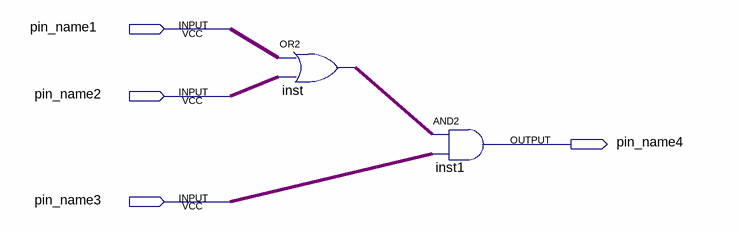
[diagram p0: schematic sheet]
// Quartus schematic Project2.bdf as structural Verilog: 2 symbols, 4 pins
module Project2 (
  input  pin_name1,
  input  pin_name2,
  input  pin_name3,
  output pin_name4
);

  wire inst_out;

  or inst (inst_out, pin_name1, pin_name2);
  and inst1 (pin_name4, inst_out, pin_name3);
endmodule
